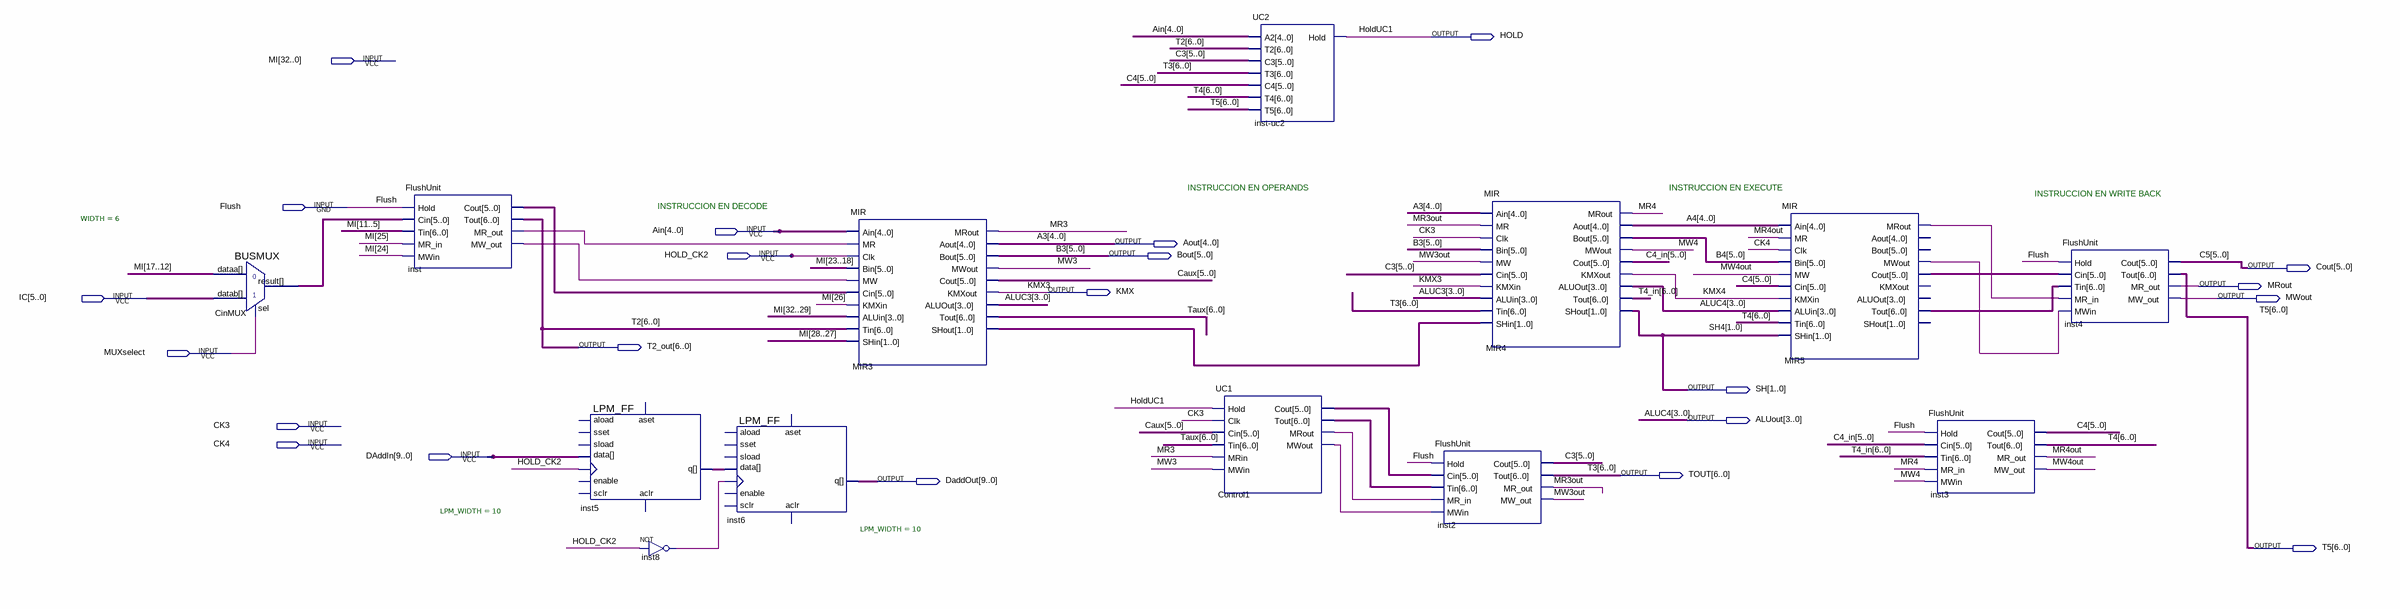
[diagram p0: schematic sheet]
// Quartus schematic MIRUnit2.bdf as structural Verilog: 13 symbols, 22 pins
module MIRUnit2 (
  input  [32:0] MI,
  input  Flush,
  input  [4:0] Ain,
  input  HOLD_CK2,
  input  [5:0] IC,
  input  MUXselect,
  input  CK3,
  input  CK4,
  input  [9:0] DAddIn,
  output HOLD,
  output [4:0] Aout,
  output [5:0] Bout,
  output [5:0] Cout,
  output MRout,
  output KMX,
  output MWout,
  output [6:0] T2_out,
  output [1:0] SH,
  output [3:0] ALUout,
  output [6:0] TOUT,
  output [9:0] DaddOut,
  output [6:0] T5
);

  wire Control1_mrout, Control1_mwout, inst8_out, inst_mr_out, inst_mw_out, KMX4, MIR5_mrout, MIR5_mwout,
       MR3, MR3out, MR4, MR4out, MW3, MW3out, MW4, MW4out;
  wire [1:0] MIR3_shout;
  wire [3:0] ALUC3;
  wire [4:0] A4;
  wire [5:0] B4, C3, C4, C4_in, Caux, CinMUX_result, Control1_cout, inst_cout, MIR5_cout;
  wire [6:0] Control1_tout, MIR5_tout, T4, T4_in, Taux;
  wire [9:0] inst5_q;

  BUSMUX #(.WIDTH(6)) CinMUX (.datab(IC), .sel(MUXselect), .dataa(MI[17:12]), .result(CinMUX_result));
  FlushUnit inst (
    .Hold(Flush), .Cin(CinMUX_result), .Tin(MI[11:5]), .MR_in(MI[25]), .MWin(MI[24]), .Cout(inst_cout),
    .Tout(T2_out), .MR_out(inst_mr_out), .MW_out(inst_mw_out));
  LPM_FF #(.LPM_WIDTH(10)) inst5 (
    .clock(HOLD_CK2), .data(DAddIn), .q(inst5_q));  // open: enable, aload, sset, sload, aset, sclr, aclr
  not inst8 (inst8_out, HOLD_CK2);
  LPM_FF #(.LPM_WIDTH(10)) inst6 (
    .clock(inst8_out), .data(inst5_q), .q(DaddOut));  // open: enable, aload, sset, sload, aset, sclr, aclr
  MIR MIR3 (
    .Ain(Ain), .MR(inst_mr_out), .Clk(HOLD_CK2), .Bin(MI[23:18]), .MW(inst_mw_out), .Cin(inst_cout),
    .KMXin(MI[26]), .ALUin(MI[32:29]), .Tin(T2_out), .SHin(MI[28:27]), .MRout(MR3), .Aout(Aout), .Bout(Bout),
    .MWout(MW3), .Cout(Caux), .KMXout(KMX), .ALUOut(ALUC3), .Tout(Taux), .SHout(MIR3_shout));
  UC1 Control1 (
    .Hold(HOLD), .Clk(CK3), .Cin(Caux), .Tin(Taux), .MRin(MR3), .MWin(MW3), .Cout(Control1_cout),
    .Tout(Control1_tout), .MRout(Control1_mrout), .MWout(Control1_mwout));
  UC2 \inst-uc2  (.A2(Ain), .T2(T2_out), .C3(C3), .T3(TOUT), .C4(C4), .T4(T4), .T5(T5), .Hold(HOLD));
  FlushUnit inst2 (
    .Hold(Flush), .Cin(Control1_cout), .Tin(Control1_tout), .MR_in(Control1_mrout), .MWin(Control1_mwout),
    .Cout(C3), .Tout(TOUT), .MR_out(MR3out), .MW_out(MW3out));
  MIR MIR4 (
    .Ain(Aout), .MR(MR3out), .Clk(CK3), .Bin(Bout), .MW(MW3out), .Cin(C3), .KMXin(KMX), .ALUin(ALUC3),
    .Tin(TOUT), .SHin(MIR3_shout), .MRout(MR4), .Aout(A4), .Bout(B4), .MWout(MW4), .Cout(C4_in),
    .KMXout(KMX4), .ALUOut(ALUout), .Tout(T4_in), .SHout(SH));
  MIR MIR5 (
    .Ain(A4), .MR(MR4out), .Clk(CK4), .Bin(B4), .MW(MW4out), .Cin(C4), .KMXin(KMX4), .ALUin(ALUout),
    .Tin(T4), .SHin(SH), .MRout(MIR5_mrout), .MWout(MIR5_mwout), .Cout(MIR5_cout), .Tout(MIR5_tout));  // open: Aout, Bout, KMXout, ALUOut, SHout
  FlushUnit inst3 (
    .Hold(Flush), .Cin(C4_in), .Tin(T4_in), .MR_in(MR4), .MWin(MW4), .Cout(C4), .Tout(T4), .MR_out(MR4out),
    .MW_out(MW4out));
  FlushUnit inst4 (
    .Hold(Flush), .Cin(MIR5_cout), .Tin(MIR5_tout), .MR_in(MIR5_mrout), .MWin(MIR5_mwout), .Cout(Cout),
    .Tout(T5), .MR_out(MRout), .MW_out(MWout));

  // Other names for the same wires on the sheet: A3[4:0] = Aout; ALUC4[3:0] = ALUout; B3[5:0] = Bout; C5[5:0] = Cout;
  //   HoldUC1 = HOLD; KMX3 = KMX; SH4[1:0] = SH; T2[6:0] = T2_out; T3[6:0] = TOUT

  // Notes on the sheet:
  //   INSTRUCCION EN OPERANDS
  //   INSTRUCCION EN EXECUTE
  //   INSTRUCCION EN WRITE BACK
  //   INSTRUCCION EN DECODE
endmodule
